# Altium schematic sheet solar.SchDoc
size A4
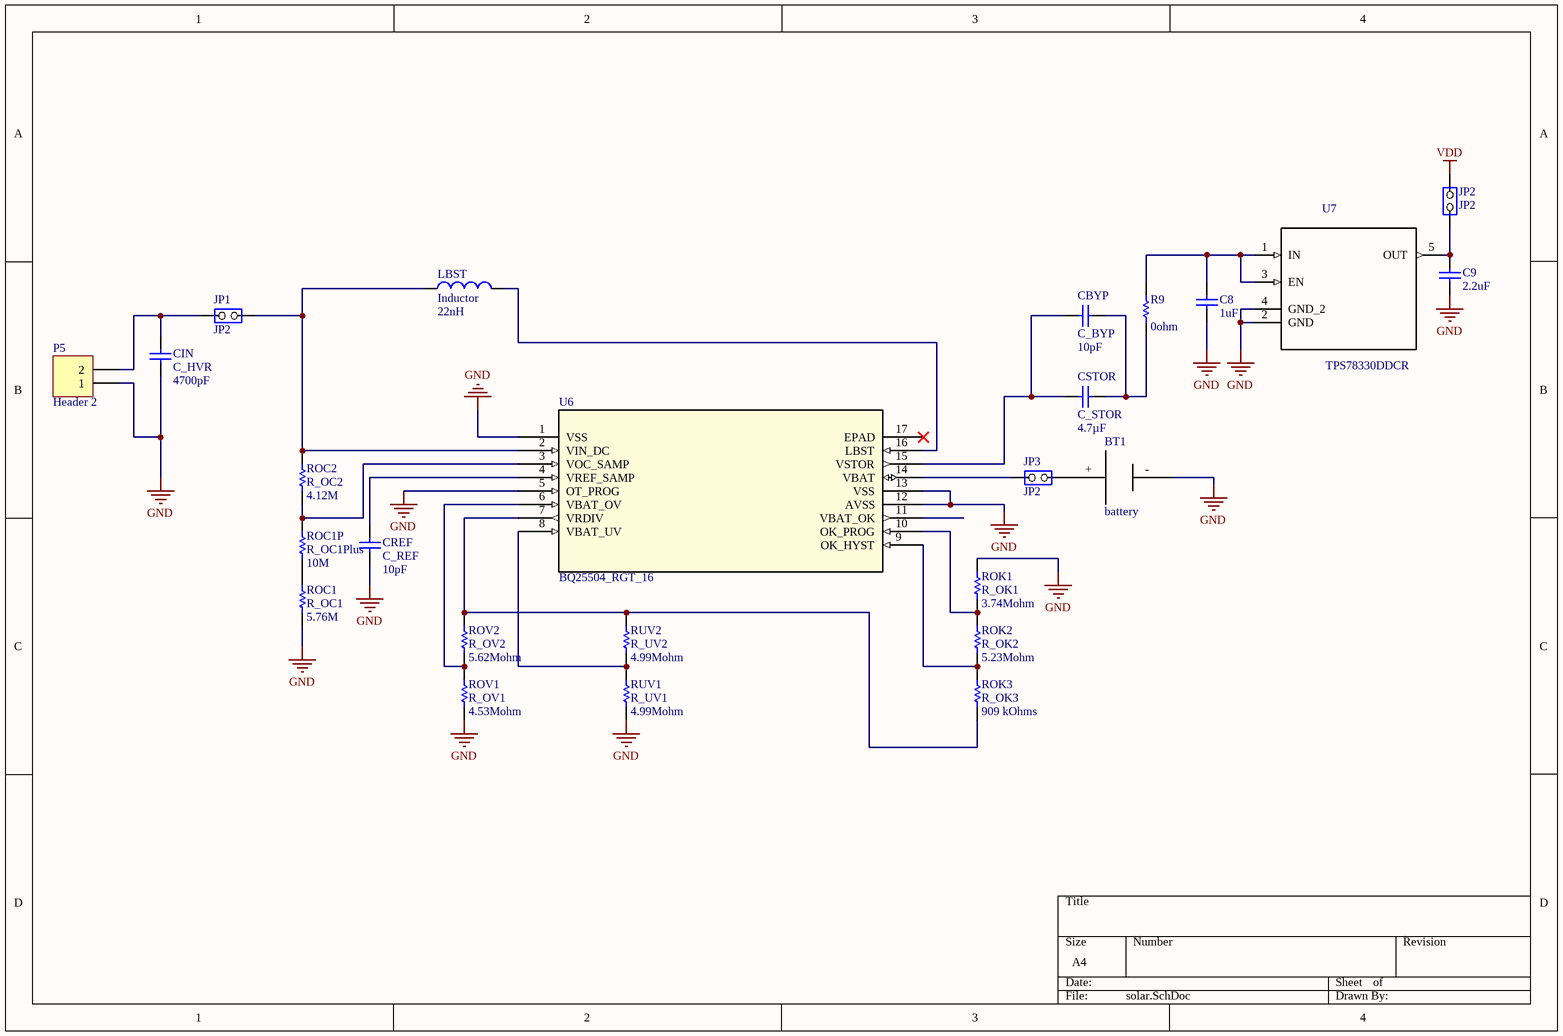
[diagram p0: solar.SchDoc]

## Parts
BT1  battery  [BATTERY]
C8  1uF  [0603C]
C9  2.2uF  [0603C]
CBYP  C_BYP  value 10pF  [0603C]
CIN  C_HVR  value 4700pF  [0603C]
CREF  C_REF  value 10pF  [0603C]
CSTOR  C_STOR  value 4.7µF  [0603C]
JP1  JP2  [SIP2/2.54]
JP2  JP2  [SIP2/2.54]
JP3  JP2  [SIP2/2.54]
LBST  Inductor  value 22nH  [INDC1608L]
P5  Header 2  [HDR1X2]
R9  value 0ohm  [0603R]
ROC1  R_OC1  value 5.76M  [0603R]
ROC1P  R_OC1Plus  value 10M  [0603R]
ROC2  R_OC2  value 4.12M  [0603R]
ROK1  R_OK1  value 3.74Mohm  [0603R]
ROK2  R_OK2  value 5.23Mohm  [0603R]
ROK3  R_OK3  value 909 kOhms  [0603R]
ROV1  R_OV1  value 4.53Mohm  [0603R]
ROV2  R_OV2  value 5.62Mohm  [0603R]
RUV1  R_UV1  value 4.99Mohm  [0603R]
RUV2  R_UV2  value 4.99Mohm  [0603R]
U6  BQ25504_RGT_16  [RGT16_1P7X1P7]
U7  TPS78330DDCR  [SOT95P280X110-5N]

## Nets
GND: BT1.- C8.1 C9.1 CIN.1 CREF.1 P5.1 ROC1.1 ROK1.2 ROV1.1 RUV1.1 U6.1(VSS) U6.5(OT_PROG) U6.12(AVSS) U6.13(VSS) U7.2(GND) U7.4(GND_2)
VDD: JP2.2(NO)
NetBT1_+: BT1.+ JP3.2(NO)
NetC8_2: C8.2 R9.2 U7.1(IN) U7.3(EN)
NetC9_2: C9.2 JP2.1(COMMON) U7.5(OUT)
NetCBYP_1: CBYP.1 CSTOR.1 U6.15(VSTOR)
NetCBYP_2: CBYP.2 CSTOR.2 R9.1
NetCIN_2: CIN.2 JP1.1(COMMON) P5.2
NetCREF_2: CREF.2 U6.4(VREF_SAMP)
NetJP1_2: JP1.2(NO) LBST.1 ROC2.2 U6.2(VIN_DC)
NetJP3_1: JP3.1(COMMON) U6.14(VBAT)
NetLBST_2: LBST.2 U6.16(LBST)
NetROC1_2: ROC1.2 ROC1P.1
NetROC1P_2: ROC1P.2 ROC2.1 U6.3(VOC_SAMP)
NetROK1_1: ROK1.1 ROK2.2 U6.10(OK_PROG)
NetROK2_1: ROK2.1 ROK3.2 U6.9(OK_HYST)
NetROK3_1: ROK3.1 ROV2.2 RUV2.2 U6.7(VRDIV)
NetROV1_2: ROV1.2 ROV2.1 U6.6(VBAT_OV)
NetRUV1_2: RUV1.2 RUV2.1 U6.8(VBAT_UV)

Not connected (* = marked no-connect by the designer): U6 11(VBAT_OK) 17(EPAD)*

## Library data of the parts
BT1 = battery: Manufacturer: Harwin Inc.; ProductNumber: M20-9990246; Vendor name: Digikey; Vendor PN: 952-2262-ND; Price: 0,11; Stock: 39.078
C8 = Cap: Capacitor; Manufacturer: AVX Corporation; Value: 1000pF; ProductNumber: 06035C102KAT2A; Vendor name: Digikey; Vendor PN: 478-1215-1-ND; Published: 8-Jun-2000; Revision: July-2002: Re-released for DXP Platform.; Publisher: Altium Limited; Price: 0.10; Stock: 446,246
C9 = Cap: Capacitor; Manufacturer: Murata Electronics North America; Value: 2.2µF; ProductNumber: GRM188R61C225KE15D; Vendor name: Digikey; Vendor PN: 490-3296-1-ND; Published: 8-Jun-2000; Revision: July-2002: Re-released for DXP Platform.; Publisher: Altium Limited; Price: 0.14; Stock: 1,593
CBYP CREF = Cap: Capacitor; Manufacturer: Murata Electronics North America; ProductNumber: GRM1885C1H100JA01D; Vendor name: Digikey; Vendor PN: 490-1403-1-ND; Published: 8-Jun-2000; LatestRevisionDate: 17-Jul-2002; LatestRevisionNote: Re-released for DXP Platform.; PackageReference: RAD-0.3; Publisher: Altium Limited; PackageDescription: Radial Cap, Thru-Hole; 2 Leads; 0.3 in Pin Spacing; Price: 0,10; Stock: 119.425
CIN = Cap: Capacitor; Manufacturer: TDK; ProductNumber: C1608NP01H472J080AA; Vendor name: Digikey; Vendor PN: 445-14083-1-ND; Published: 8-Jun-2000; LatestRevisionDate: 17-Jul-2002; LatestRevisionNote: Re-released for DXP Platform.; PackageReference: RAD-0.3; Publisher: Altium Limited; PackageDescription: Radial Cap, Thru-Hole; 2 Leads; 0.3 in Pin Spacing; Price: 0.35; Stock: 9,115
CSTOR = Cap: Capacitor; Manufacturer: Taiyo Yuden; ProductNumber: JMK107BJ475KA-T; Vendor name: Digikey; Vendor PN: 587-1785-1-ND; Published: 8-Jun-2000; LatestRevisionDate: 17-Jul-2002; LatestRevisionNote: Re-released for DXP Platform.; PackageReference: RAD-0.3; Publisher: Altium Limited; PackageDescription: Radial Cap, Thru-Hole; 2 Leads; 0.3 in Pin Spacing; Price: 0,12; Stock: 190.175
JP1-JP3 = JP2: Manufacturer: Harwin Inc.; ProductNumber: M20-9990246; Vendor name: Digikey; Vendor PN: 952-2262-ND; Price: 0,11; Stock: 39.078
LBST = Inductor: Manufacturer: Johanson Technology; Code_IEC: 1005; ProductNumber: L-14C22NJV4T; Vendor name: Digikey; Vendor PN: 712-1438-1-ND; Published: 8-Jun-2000; LatestRevisionDate: 29-May-2009; LatestRevisionNote: IPC-7351 Footprint Added.; PackageReference: 0402-A; Publisher: Altium Limited; PackageDescription: Chip Inductor; Code_JEITA: 0402; Price: 0.10; Stock: 25,025
P5 = Header 2: Header, 2-Pin; Manufacturer: Harwin Inc.; ProductNumber: M20-9990246; Vendor name: Digikey; Vendor PN: 952-2262-ND; LatestRevisionDate: 17-Jul-2002; LatestRevisionNote: Re-released for DXP Platform.; Publisher: Altium Limited; Price: 0,11; Stock: 39.078
R9 = Res1: Resistor; Manufacturer: Yageo; ProductNumber: RC0603JR-070RL; Vendor name: Digikey; Vendor PN: 311-0.0GRCT-ND; Published: 8-Jun-2000; LatestRevisionDate: 17-Jul-2002; LatestRevisionNote: Re-released for DXP Platform.; PackageReference: AXIAL-0.3; Publisher: Altium Limited; PackageDescription: Axial Device, Thru-Hole; 2 Leads; 0.3 in Pin Spacing; Price: 0,10; Stock: 9.866.782
ROC1 = Res1: Resistor; Manufacturer: Vishay Dale; ProductNumber: CRCW06035M76FKEA; Vendor name: Digikey; Vendor PN: 541-5.76MHCT-ND; Published: 8-Jun-2000; LatestRevisionDate: 17-Jul-2002; LatestRevisionNote: Re-released for DXP Platform.; PackageReference: AXIAL-0.3; Publisher: Altium Limited; PackageDescription: Axial Device, Thru-Hole; 2 Leads; 0.3 in Pin Spacing; Price: 0.10; Stock: 39,086
ROC1P = Res1: Resistor; Manufacturer: Yageo; ProductNumber: RC0603JR-0710ML; Vendor name: Digikey; Vendor PN: 311-10MGRCT-ND; Published: 8-Jun-2000; LatestRevisionDate: 17-Jul-2002; LatestRevisionNote: Re-released for DXP Platform.; PackageReference: AXIAL-0.3; Publisher: Altium Limited; PackageDescription: Axial Device, Thru-Hole; 2 Leads; 0.3 in Pin Spacing; Price: 0,10; Stock: 580.946
ROC2 = Res1: Resistor; Manufacturer: Vishay Dale; ProductNumber: CRCW06034M12FKEA; Vendor name: Digikey; Vendor PN: 541-4.12MHCT-ND; Published: 8-Jun-2000; LatestRevisionDate: 17-Jul-2002; LatestRevisionNote: Re-released for DXP Platform.; PackageReference: AXIAL-0.3; Publisher: Altium Limited; PackageDescription: Axial Device, Thru-Hole; 2 Leads; 0.3 in Pin Spacing; Price: 0,10; Stock: 15,060
ROK1 = Res1: Resistor; Manufacturer: Stackpole Electronics Inc.; ProductNumber: RMCF0603FT3M74; Vendor name: Digikey; Vendor PN: RMCF0603FT3M74CT-ND; Published: 8-Jun-2000; LatestRevisionDate: 17-Jul-2002; LatestRevisionNote: Re-released for DXP Platform.; PackageReference: AXIAL-0.3; Publisher: Altium Limited; PackageDescription: Axial Device, Thru-Hole; 2 Leads; 0.3 in Pin Spacing; Price: 0,08; Stock: 1.152
ROK2 = Res1: Resistor; Manufacturer: Vishay Dale; ProductNumber: CRCW06035M23FKEA; Vendor name: Digikey; Vendor PN: 541-5.23MHCT-ND; Published: 8-Jun-2000; LatestRevisionDate: 17-Jul-2002; LatestRevisionNote: Re-released for DXP Platform.; PackageReference: AXIAL-0.3; Publisher: Altium Limited; PackageDescription: Axial Device, Thru-Hole; 2 Leads; 0.3 in Pin Spacing; Price: 0.10; Stock: 18,443
ROK3 = Res1: Resistor; Manufacturer: Yageo; ProductNumber: RC0603FR-07909KL; Vendor name: Digikey; Vendor PN: 311-909KHRCT-ND; Published: 8-Jun-2000; LatestRevisionDate: 17-Jul-2002; LatestRevisionNote: Re-released for DXP Platform.; PackageReference: AXIAL-0.3; Publisher: Altium Limited; PackageDescription: Axial Device, Thru-Hole; 2 Leads; 0.3 in Pin Spacing; Price: 0.10; Stock: 129,610
ROV1 = Res1: Resistor; Manufacturer: Stackpole Electronics Inc.; ProductNumber: RMCF0603FT4M53; Vendor name: Digikey; Vendor PN: RMCF0603FT4M53CT-ND; Published: 8-Jun-2000; LatestRevisionDate: 17-Jul-2002; LatestRevisionNote: Re-released for DXP Platform.; PackageReference: AXIAL-0.3; Publisher: Altium Limited; PackageDescription: Axial Device, Thru-Hole; 2 Leads; 0.3 in Pin Spacing; Price: 0,08; Stock: 9 501
ROV2 = Res1: Resistor; Manufacturer: Stackpole Electronics Inc.; ProductNumber: RMCF0603FT5M62; Vendor name: Digikey; Vendor PN: RMCF0603FT5M62CT-ND; Published: 8-Jun-2000; LatestRevisionDate: 17-Jul-2002; LatestRevisionNote: Re-released for DXP Platform.; PackageReference: AXIAL-0.3; Publisher: Altium Limited; PackageDescription: Axial Device, Thru-Hole; 2 Leads; 0.3 in Pin Spacing; Price: 0,08; Stock: 9.800
RUV1 RUV2 = Res1: Resistor; Manufacturer: Vishay Dale; ProductNumber: CRCW06034M99FKEA; Vendor name: Digikey; Vendor PN: 541-4.99MHCT-ND; Published: 8-Jun-2000; LatestRevisionDate: 17-Jul-2002; LatestRevisionNote: Re-released for DXP Platform.; PackageReference: AXIAL-0.3; Publisher: Altium Limited; PackageDescription: Axial Device, Thru-Hole; 2 Leads; 0.3 in Pin Spacing; Price: 0.10; Stock: 103,539
U6 = BQ25504_RGT_16: Imported; Manufacturer: Texas Instruments; INDUSTRY_STD_PKG_TYPE: QFN; FAMILY_NAME: BATTERY CHARGE MANAGEMENT; PIN_COUNT: 16; PACKAGE_DESIGNATOR: RGT; ProductNumber: BQ25504RGTT; Vendor name: Digikey; Vendor PN: 296-29741-1-ND; Datasheet_URL: http://www.ti.com/lit/gpn/BQ25504; GENERIC_PART_NUMBER: BQ25504; Type: Type; RefDes: RefDes; Price: 5,66; Stock: 2.933
U7 = TPS78330DDCR: IC REG LINEAR 3V 150MA SOT23-5; MF: Texas Instruments; Vendor name: Digikey; Vendor PN: 296-25880-1-ND; Availability: Good; Price: 0,83; MP: TPS78330DDCR; Package: SOT-23-5 Texas Instruments; Value: *; Manufacturer: Texas Instruments; ProductNumber: TPS78330DDCR; Stock: 2.618